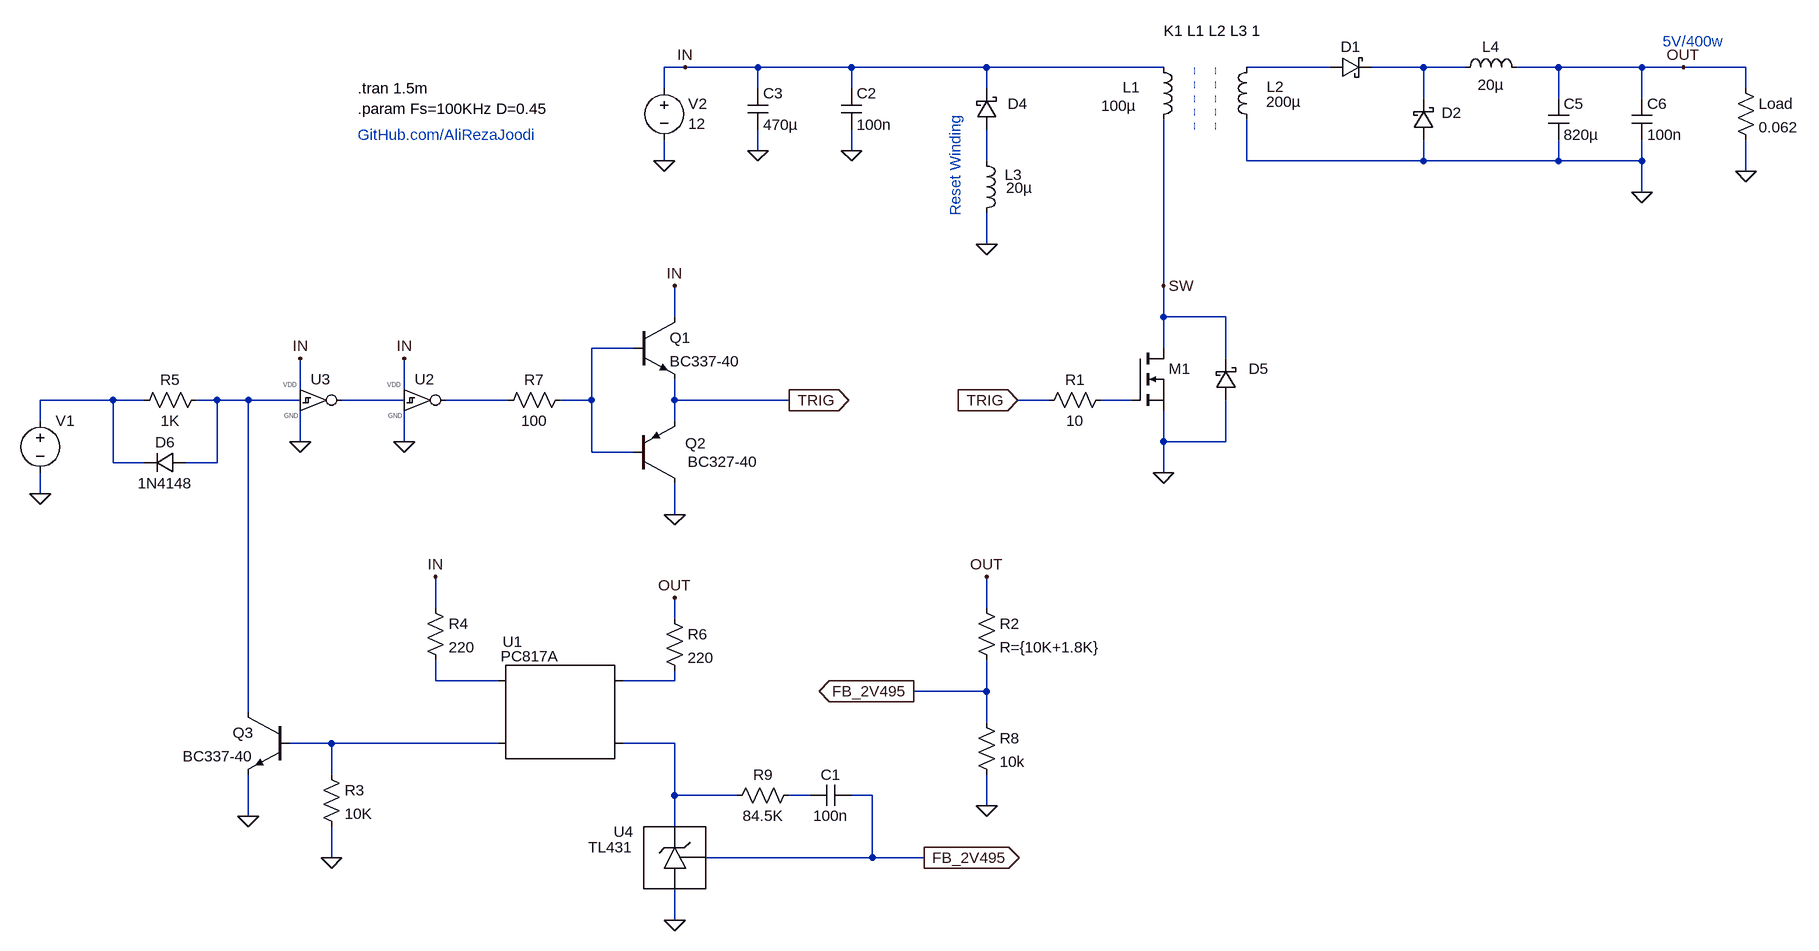
[diagram p0: schematic v2.1.asc]
v2.1.asc, the LTspice schematic file:
Version 4.1
SHEET 1 2268 1748
WIRE 96 96 64 96
WIRE 208 96 96 96
WIRE 352 96 208 96
WIRE 560 96 352 96
WIRE 832 96 560 96
WIRE 1088 96 960 96
WIRE 1232 96 1152 96
WIRE 1296 96 1232 96
WIRE 1440 96 1376 96
WIRE 1568 96 1440 96
WIRE 1632 96 1568 96
WIRE 1728 96 1632 96
WIRE 64 128 64 96
WIRE 208 128 208 96
WIRE 352 128 352 96
WIRE 560 128 560 96
WIRE 1728 128 1728 96
WIRE 1232 144 1232 96
WIRE 1440 144 1440 96
WIRE 1568 144 1568 96
WIRE 208 224 208 192
WIRE 352 224 352 192
WIRE 64 240 64 208
WIRE 560 240 560 192
WIRE 960 240 960 176
WIRE 1232 240 1232 208
WIRE 1232 240 960 240
WIRE 1440 240 1440 208
WIRE 1440 240 1232 240
WIRE 1568 240 1568 208
WIRE 1568 240 1440 240
WIRE 1728 256 1728 208
WIRE 1568 288 1568 240
WIRE 560 368 560 320
WIRE 832 432 832 176
WIRE 80 480 80 432
WIRE 832 480 832 432
WIRE 928 480 832 480
WIRE 16 528 -48 528
WIRE 832 528 832 480
WIRE 928 544 928 480
WIRE -496 592 -496 544
WIRE -336 592 -336 544
WIRE -784 608 -896 608
WIRE -736 608 -784 608
WIRE -624 608 -656 608
WIRE -576 608 -624 608
WIRE -496 608 -576 608
WIRE -336 608 -432 608
WIRE -176 608 -272 608
WIRE -48 608 -48 528
WIRE -48 608 -96 608
WIRE 80 608 80 576
WIRE 256 608 80 608
WIRE 656 608 608 608
WIRE 784 608 736 608
WIRE -896 640 -896 608
WIRE 80 640 80 608
WIRE -496 672 -496 624
WIRE -336 672 -336 624
WIRE 832 672 832 624
WIRE 928 672 928 608
WIRE 928 672 832 672
WIRE -48 688 -48 608
WIRE 16 688 -48 688
WIRE -784 704 -784 608
WIRE -736 704 -784 704
WIRE -624 704 -624 608
WIRE -624 704 -672 704
WIRE 832 720 832 672
WIRE -896 752 -896 720
WIRE 80 784 80 736
WIRE -288 928 -288 880
WIRE 560 928 560 880
WIRE 80 944 80 912
WIRE -288 1040 -288 1008
WIRE -192 1040 -288 1040
WIRE 80 1040 80 1024
WIRE 80 1040 0 1040
WIRE 560 1056 560 1008
WIRE 560 1056 448 1056
WIRE -576 1088 -576 608
WIRE 560 1104 560 1056
WIRE -448 1136 -512 1136
WIRE -192 1136 -448 1136
WIRE 80 1136 0 1136
WIRE -448 1184 -448 1136
WIRE 80 1216 80 1136
WIRE 176 1216 80 1216
WIRE 288 1216 256 1216
WIRE 384 1216 352 1216
WIRE 560 1232 560 1184
WIRE -576 1248 -576 1184
WIRE 80 1264 80 1216
WIRE -448 1312 -448 1264
WIRE 384 1312 384 1216
WIRE 384 1312 128 1312
WIRE 464 1312 384 1312
WIRE 80 1408 80 1360
FLAG -896 752 0
FLAG 64 240 0
FLAG 832 720 0
FLAG 352 224 0
FLAG 208 224 0
FLAG 96 96 IN
FLAG 1568 288 0
FLAG 80 432 IN
FLAG 80 784 0
FLAG 832 432 SW
FLAG 560 368 0
FLAG 1728 256 0
FLAG -576 1248 0
FLAG -448 1312 0
FLAG -288 880 IN
FLAG -336 544 IN
FLAG -336 672 0
FLAG -496 544 IN
FLAG -496 672 0
FLAG 80 1408 0
FLAG 1632 96 OUT
FLAG 560 1232 0
FLAG 80 912 OUT
FLAG 608 608 TRIG
IOPIN 608 608 In
FLAG 256 608 TRIG
IOPIN 256 608 Out
FLAG 560 880 OUT
FLAG 448 1056 FB_2V495
IOPIN 448 1056 Out
FLAG 464 1312 FB_2V495
IOPIN 464 1312 Out
SYMBOL voltage -896 624 R0
WINDOW 3 24 96 Invisible 2
WINDOW 123 0 0 Left 0
WINDOW 39 39 69 Left 2
SYMATTR Value PULSE(0 12 0 {0.01/Fs} {0.01/Fs} {D/Fs} {1/Fs})
SYMATTR InstName V1
SYMBOL res 640 624 R270
WINDOW 0 32 56 VTop 2
WINDOW 3 0 56 VBottom 2
SYMATTR InstName R1
SYMATTR Value 10
SYMBOL ind 816 80 R0
WINDOW 0 -47 47 Left 2
WINDOW 3 -80 75 Left 2
SYMATTR InstName L1
SYMATTR Value 100µ
SYMATTR Type ind
SYMBOL voltage 64 112 R0
WINDOW 0 37 40 Left 2
WINDOW 3 37 71 Left 2
WINDOW 123 0 0 Left 0
WINDOW 39 0 0 Left 0
SYMATTR InstName V2
SYMATTR Value 12
SYMBOL cap 336 128 R0
SYMATTR InstName C2
SYMATTR Value 100n
SYMBOL cap 192 128 R0
SYMATTR InstName C3
SYMATTR Value 470µ
SYMBOL ind 976 80 M0
WINDOW 0 -42 46 Left 2
WINDOW 3 -68 69 Left 2
SYMATTR InstName L2
SYMATTR Value 200µ
SYMATTR Type ind
SYMBOL cap 1424 144 R0
SYMATTR InstName C5
SYMATTR Value 820µ
SYMBOL cap 1552 144 R0
SYMATTR InstName C6
SYMATTR Value 100n
SYMBOL res 1712 112 R0
SYMATTR InstName Load
SYMATTR Value 0.062
SYMBOL ind 1280 112 R270
WINDOW 0 32 56 VTop 2
WINDOW 3 5 56 VBottom 2
SYMATTR InstName L4
SYMATTR Value 20µ
SYMBOL nmos 784 528 R0
WINDOW 3 56 72 Invisible 2
SYMATTR Value BSC100N06LS3
SYMATTR InstName M1
SYMBOL npn 16 480 R0
SYMATTR InstName Q1
SYMATTR Value BC337-40
SYMBOL pnp 16 736 M180
WINDOW 0 80 62 Left 2
WINDOW 3 84 33 Left 2
SYMATTR InstName Q2
SYMATTR Value BC327-40
SYMBOL res -752 624 R270
WINDOW 0 32 56 VTop 2
WINDOW 3 0 56 VBottom 2
SYMATTR InstName R5
SYMATTR Value 1K
SYMBOL ind 544 336 M180
WINDOW 0 44 75 Left 2
WINDOW 3 46 55 Left 2
SYMATTR InstName L3
SYMATTR Value 20µ
SYMATTR Type ind
SYMBOL schottky 1088 112 R270
WINDOW 0 32 32 VTop 2
WINDOW 3 0 32 Invisible 2
SYMATTR InstName D1
SYMATTR Value RBQ30NS100A
SYMBOL schottky 1216 208 M180
WINDOW 0 44 42 Left 2
WINDOW 3 44 20 Invisible 2
SYMATTR InstName D2
SYMATTR Value RBQ20NS100A
SYMBOL schottky 544 192 M180
WINDOW 0 48 40 Left 2
WINDOW 3 46 18 Invisible 2
SYMATTR InstName D4
SYMATTR Value RB228NS100
SYMBOL schottky 912 608 M180
WINDOW 0 51 48 Left 2
WINDOW 3 51 23 Invisible 2
SYMATTR InstName D5
SYMATTR Value RBQ30NS100A
SYMBOL npn -512 1088 M0
SYMATTR InstName Q3
SYMATTR Value BC337-40
SYMBOL res -464 1168 R0
SYMATTR InstName R3
SYMATTR Value 10K
SYMBOL res -304 912 R0
SYMATTR InstName R4
SYMATTR Value 220
SYMBOL Optos\\PC817A -96 1088 M0
WINDOW 0 73 -108 Center 2
WINDOW 3 47 -86 Center 2
SYMATTR InstName U1
SYMBOL res 64 928 R0
SYMATTR InstName R6
SYMATTR Value 220
SYMBOL res -80 592 R90
WINDOW 0 0 56 VBottom 2
WINDOW 3 32 56 VTop 2
SYMATTR InstName R7
SYMATTR Value 100
SYMBOL MyLib\\Digital\\CD40106B -336 576 R0
WINDOW 38 16 64 Invisible 2
SYMATTR InstName U2
SYMATTR SpiceLine vdd=12
SYMBOL MyLib\\Digital\\CD40106B -496 576 R0
WINDOW 38 16 64 Invisible 2
SYMATTR InstName U3
SYMBOL diode -672 688 R90
WINDOW 0 0 32 VBottom 2
WINDOW 3 32 32 VTop 2
SYMATTR InstName D6
SYMATTR Value 1N4148
SYMBOL MyLib\\Regulator_Linear\\TL431 80 1312 M0
SYMATTR InstName U4
SYMBOL res 544 912 R0
SYMATTR InstName R2
SYMATTR Value R={10K+1.8K}
SYMBOL res 544 1088 R0
SYMATTR InstName R8
SYMATTR Value 10k
SYMBOL cap 352 1200 R90
WINDOW 0 0 32 VBottom 2
WINDOW 3 32 32 VTop 2
SYMATTR InstName C1
SYMATTR Value 100n
SYMBOL res 272 1200 R90
WINDOW 0 0 56 VBottom 2
WINDOW 3 32 56 VTop 2
SYMATTR InstName R9
SYMATTR Value 84.5K
TEXT -408 160 Left 2 !.param Fs=100KHz D=0.45
TEXT -408 128 Left 2 !.tran 1.5m
TEXT 832 40 Left 2 !K1 L1 L2 L3 1
TEXT 512 168 VRight 2 ;Reset Winding
TEXT -408 200 Left 2 ;GitHub.com/AliRezaJoodi
TEXT 1600 56 Left 2 ;5V/400w
LINE Normal 880 192 880 96 2
LINE Normal 912 192 912 96 2

The netlist it stands for:
* v2.1.asc
V1 N005 0 PULSE(0 12 0 {0.01/Fs} {0.01/Fs} {D/Fs} {1/Fs})
R1 TRIG N009 10
L1 IN SW 100µ
V2 IN 0 12
C2 IN 0 100n
C3 IN 0 470µ
L2 N001 0 200µ
C5 OUT 0 820µ
C6 OUT 0 100n
R§Load OUT 0 0.062
L4 N002 OUT 20µ
M1 SW N009 0 0 BSC100N06LS3
Q1 IN N004 TRIG 0 BC337-40
Q2 0 N004 TRIG 0 BC327-40
R5 N005 N006 1K
L3 0 N003 20µ
D1 N001 N002 RBQ30NS100A
D2 0 N002 RBQ20NS100A
D4 N003 IN RB228NS100
D5 0 SW RBQ30NS100A
Q3 N006 N012 0 0 BC337-40
R3 N012 0 10K
R4 IN N010 220
X§U1 N011 N013 N010 N012 PC817 Igain=1m
R6 OUT N011 220
R7 N004 N008 100
X§U2 N007 N008 IN 0 CD40106B vdd=12 speed=2 tripdt=100n  ; pins in out VDD GND
X§U3 N006 N007 IN 0 CD40106B vdd=5 speed=2 tripdt=100n  ; pins in out VDD GND
D6 N006 N005 1N4148
X§U4 N013 0 FB_2V495 TL431  ; pins CATHODE ANODE REF
R2 OUT FB_2V495 R={10K+1.8K}
R8 FB_2V495 0 10k
C1 FB_2V495 N014 100n
R9 N014 N013 84.5K
.model D D
.lib standard.dio
.model NPN NPN
.model PNP PNP
.lib standard.bjt
.model NMOS NMOS
.model PMOS PMOS
.lib standard.mos
.param Fs=100KHz D=0.45
.tran 1.5m
K1 L1 L2 L3 1
* Reset Winding
* GitHub.com/AliRezaJoodi
* 5V/400w
.lib PC817.sub
.lib MyLib/Digital/_CD4xxx.lib
.lib MyLib/Regulator_Linear/TL431.lib
.backanno
.end